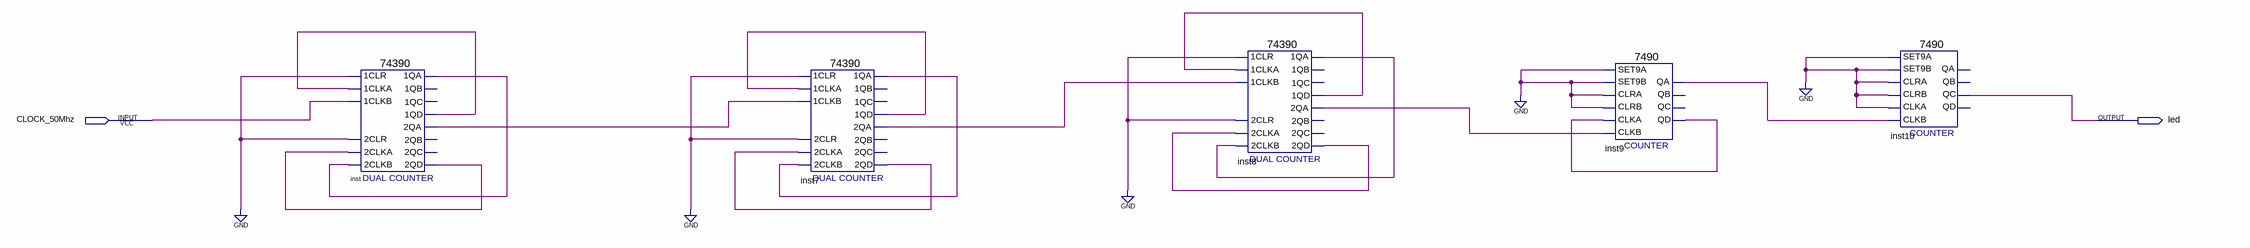
[diagram p0: schematic sheet]
// Quartus schematic horloge_1hz.bdf as structural Verilog: 5 symbols, 2 pins
module horloge_1hz (
  input  CLOCK_50Mhz,
  output led
);

  wire inst7_1qa, inst7_1qd, inst7_2qa, inst7_2qd, inst8_1qa, inst8_1qd, inst8_2qa, inst8_2qd, inst9_qa,
       inst9_qd, inst_1qa, inst_1qd, inst_2qa, inst_2qd;

  \74390  inst (
    .\2CLKA (inst_2qd), .\2CLR (1'b0), .\2CLKB (inst_1qa), .\1CLR (1'b0), .\1CLKA (inst_1qd),
    .\1CLKB (CLOCK_50Mhz), .\1QA (inst_1qa), .\1QD (inst_1qd), .\2QA (inst_2qa), .\2QD (inst_2qd));  // open: 1QB, 1QC, 2QB, 2QC
  \74390  inst7 (
    .\2CLKA (inst7_2qd), .\2CLR (1'b0), .\2CLKB (inst7_1qa), .\1CLR (1'b0), .\1CLKA (inst7_1qd),
    .\1CLKB (inst_2qa), .\1QA (inst7_1qa), .\1QD (inst7_1qd), .\2QA (inst7_2qa), .\2QD (inst7_2qd));  // open: 1QB, 1QC, 2QB, 2QC
  \74390  inst8 (
    .\2CLKA (inst8_2qd), .\2CLR (1'b0), .\2CLKB (inst8_1qa), .\1CLR (1'b0), .\1CLKA (inst8_1qd),
    .\1CLKB (inst7_2qa), .\1QA (inst8_1qa), .\1QD (inst8_1qd), .\2QA (inst8_2qa), .\2QD (inst8_2qd));  // open: 1QB, 1QC, 2QB, 2QC
  \7490  inst9 (
    .SET9A(1'b0), .CLRA(1'b0), .SET9B(1'b0), .CLKB(inst8_2qa), .CLKA(inst9_qd), .CLRB(1'b0), .QD(inst9_qd),
    .QA(inst9_qa));  // open: QB, QC
  \7490  inst10 (
    .SET9A(1'b0), .CLRA(1'b0), .SET9B(1'b0), .CLKB(inst9_qa), .CLKA(1'b0), .CLRB(1'b0), .QC(led));  // open: QD, QA, QB
endmodule
